# EAGLE design MC24LC512Shield (EAGLE 7.4.0)
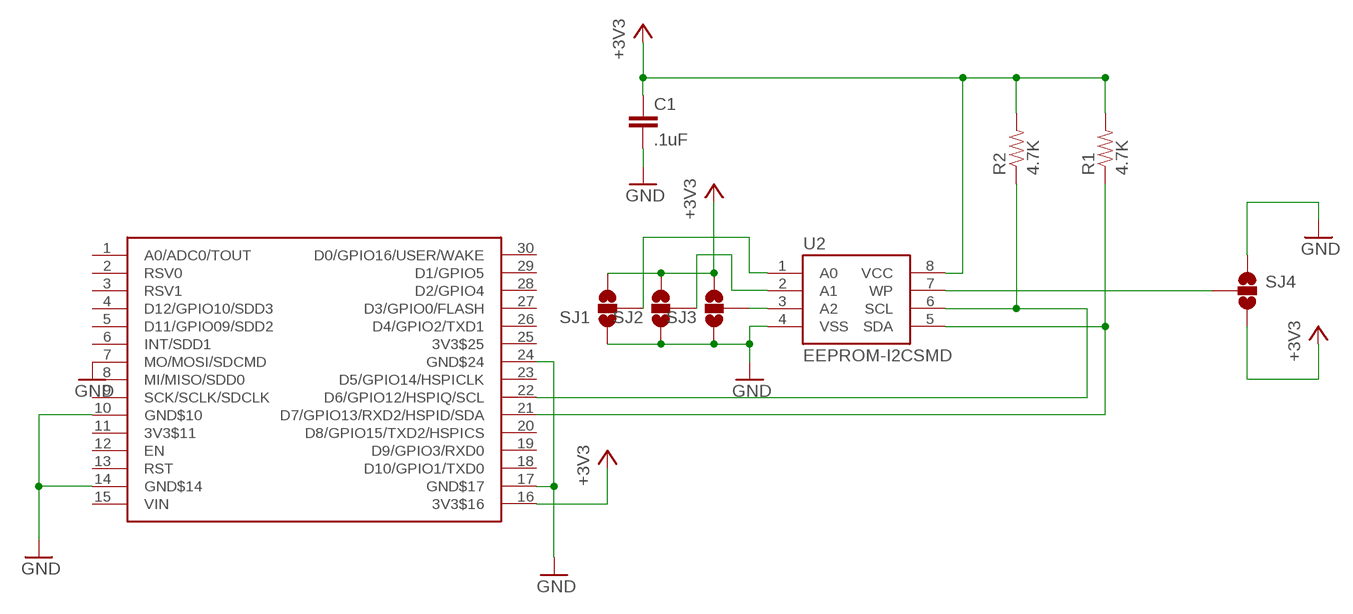
[diagram p0: schematic, sheet 1]

## Parts
C1  .1uF  CAP0603-CAP  [0603-CAP]
R1  4.7K  RESISTOR0603-RES  [0603-RES]
R2  4.7K  RESISTOR0603-RES  [0603-RES]
SJ1  SOLDERJUMPER_2WAYPASTE1&2  [SJ_3_PASTE1&2]
SJ2  SOLDERJUMPER_2WAYPASTE1&2  [SJ_3_PASTE1&2]
SJ3  SOLDERJUMPER_2WAYPASTE1&2  [SJ_3_PASTE1&2]
SJ4  SOLDERJUMPER_2WAYPASTE1&2  [SJ_3_PASTE1&2]
U2  EEPROM-I2CSMD  [SO08]
U$2  NERDSHIELD  [NERDUINO_STACK]

## Nets
+3V3: C1.1 R1.2 R2.2 SJ1.3 SJ2.3 SJ3.3 SJ4.3 U2.8(VCC) U$2.16(3V3$16)
GND: C1.2 SJ1.1 SJ2.1 SJ3.1 SJ4.1 U2.4(VSS) U$2.7(MO/MOSI/SDCMD) U$2.10(GND$10) U$2.14(GND$14) U$2.17(GND$17) U$2.24(GND$24)
N$2: R1.1 U2.5(SDA) U$2.21(D7/GPIO13/RXD2/HSPID/SDA)
N$4: SJ3.2 U2.3(A2)
N$5: R2.1 U2.6(SCL) U$2.22(D6/GPIO12/HSPIQ/SCL)
N$6: SJ2.2 U2.2(A1)
N$7: SJ1.2 U2.1(A0)
N$8: SJ4.2 U2.7(WP)
Unconnected: U$2.1(A0/ADC0/TOUT) U$2.2(RSV0) U$2.3(RSV1) U$2.4(D12/GPIO10/SDD3) U$2.5(D11/GPIO09/SDD2) U$2.6(INT/SDD1) U$2.8(MI/MISO/SDD0) U$2.9(SCK/SCLK/SDCLK) U$2.11(3V3$11) U$2.12(EN) U$2.13(RST) U$2.15(VIN) U$2.18(D10/GPIO1/TXD0) U$2.19(D9/GPIO3/RXD0) U$2.20(D8/GPIO15/TXD2/HSPICS) U$2.23(D5/GPIO14/HSPICLK) U$2.25(3V3$25) U$2.26(D4/GPIO2/TXD1) U$2.27(D3/GPIO0/FLASH) U$2.28(D2/GPIO4) U$2.29(D1/GPIO5) U$2.30(D0/GPIO16/USER/WAKE)

## Library data of the parts
C1 = SparkFun:CAP: Capacitor Standard 0603 ceramic capacitor, and 0.1" leaded capacitor.
R1 R2 = SparkFun:RESISTOR: Resistor Basic schematic elements and footprints for 0603, 1206, and PTH resistors.
SJ1-SJ4 = SparkFun:SOLDERJUMPER_2WAY: Solder Jumper 2 way solder jumper
U2 = SparkFun-DigitalIC:EEPROM-I2C: I2C EEPROM chips, 24LC256 (and others)
U$2 = NerduinoShieldLib:NERDSHIELD

## Board
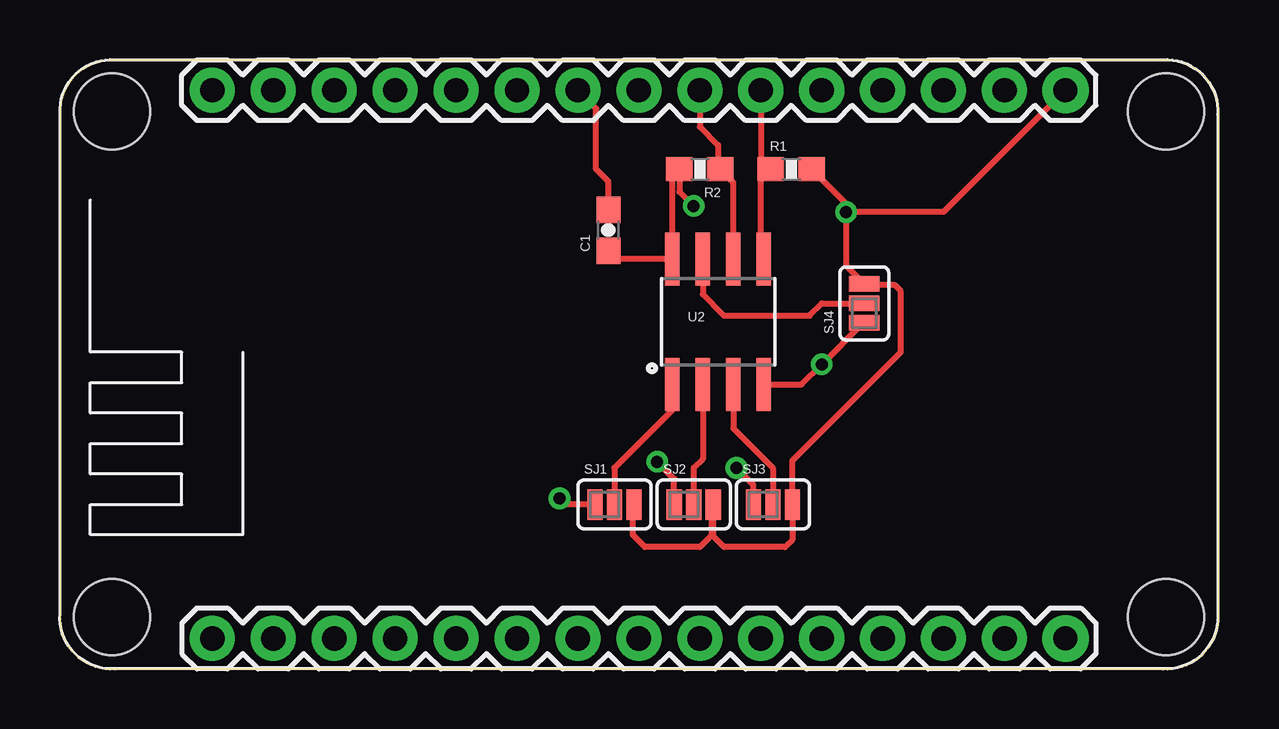
[diagram p1: board, top side]
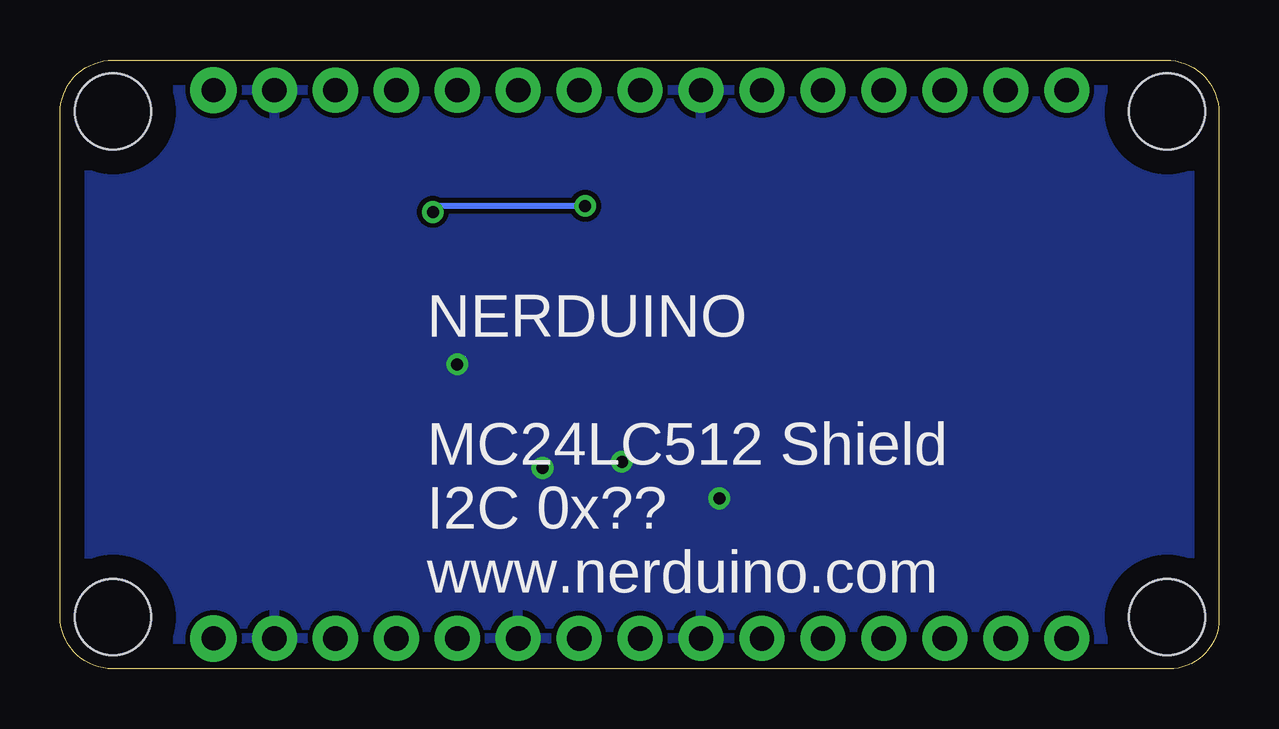
[diagram p2: board, bottom side, seen from below]

Size 48.31 x 25.39 mm. Coordinates in mm from the lower left corner, seen from the top.
Outline: 48.31,2.2 48.31,23.17 arc90 46.09,25.39 2.21,25.39 arc90 0,23.18 0,2.08 arc90 2.08,0 46.12,0 arc90 48.31,2.2
Copper layers (1*16): Top 0.035mm / dielectric 1.5mm / Bottom 0.035mm
Design rules "default": minimum track width 10mil, minimum drill 24mil, track to track 8mil, track to pad 8mil, pad to pad 8mil, via to via 8mil, smd to smd 8mil, copper to edge 40mil, drill to drill 8mil, minimum pad ring 10mil, minimum via ring 8mil, stop-mask expansion 4mil, vias tented up to drill 0mil, thermal gap 10mil

### Footprints (pad centres in the part's own frame; a part is rotated, then mirrored left to right if it is on the bottom)
0603-CAP = smd 1.1 x 1: 1 -0.85,0; 2 0.85,0
0603-RES = smd 1.1 x 1: 1 -0.85,0; 2 0.85,0
SJ_3_PASTE1&2 = smd 0.635 x 1.27: 1 -0.813,0; 2 0,0; 3 0.813,0
SO08 = smd 0.61 x 2.21: 1 -1.905,-2.616; 2 -0.635,-2.616; 3 0.635,-2.616; 4 1.905,-2.616; 5 1.905,2.616; 6 0.635,2.616; 7 -0.635,2.616; 8 -1.905,2.616
NERDUINO_STACK = drill 1.016 pad 1.88: 1 -17.78,-5.08; 2 -15.24,-5.08; 3 -12.7,-5.08; 4 -10.16,-5.08; 5 -7.62,-5.08; 6 -5.08,-5.08; 7 -2.54,-5.08; 8 0,-5.08; 9 2.54,-5.08; 10 5.08,-5.08; 11 7.62,-5.08; 12 10.16,-5.08; 13 12.7,-5.08; 14 15.24,-5.08; 17 15.24,17.78; 18 12.7,17.78; 19 10.16,17.78; 20 7.62,17.78; 21 5.08,17.78; 22 2.54,17.78; 23 0,17.78; 24 -2.54,17.78; 25 -5.08,17.78; 26 -7.62,17.78; 27 -10.16,17.78; 28 -12.7,17.78; 29 -15.24,17.78; 30 -17.78,17.78 | drill 1 pad 1.93: 15 17.78,-5.08; 16 17.78,17.78 | hole 3.175: -21.971,16.891; -21.971,-4.191; 21.971,-4.191; 21.971,16.891

### Placement (x,y rotation side)
C1  22.86,18.29 90 top
R1  30.48,20.83 0 top
R2  26.67,20.83 180 top
SJ1  23.11,6.86 0 top
SJ2  26.42,6.86 0 top
SJ3  29.72,6.86 0 top
SJ4  33.53,15.24 90 top
U2  27.43,14.48 0 top
U$2  24.13,6.35 0 top

### Tracks (layer width: path | path; a pad name or v marks a point on that pad's centre or on a via)
+3V3  (via drill 0.5)
  Top 0.254: SJ1.3 23.88,6.81 23.88,5.59 24.38,5.08 26.67,5.08 27.23,5.64 SJ2.3 27.18,6.81 27.18,5.59 27.69,5.08 30.23,5.08 30.53,5.38 SJ3.3 30.53,8.69 35.05,13.21 35.05,15.75 34.8,16 33.58,16 SJ4.3 32.77,16.81 v32.77,19.05 | C1.1 23.2,17.09 U2.8 25.53,20.54 R2.2 25.82,19.9 v26.42,19.3 | v32.77,19.05 32.77,19.39 R1.2 | U$2.16 36.83,19.05 v32.77,19.05
  Bottom 0.254: v26.42,19.3 32.51,19.3 v32.77,19.05
GND  (via drill 0.5)
  Top 0.254: SJ3.1 28.91,7.67 v28.19,8.38 | SJ2.1 25.6,7.93 v24.89,8.64 | SJ1.1 21.08,6.86 v20.83,7.11 | U2.4 30.91,11.86 v31.75,12.7 33.48,14.43 SJ4.1 | C1.2 22.86,20.32 22.35,20.83 22.35,23.37 U$2.24
  Bottom 0.254: v28.19,8.38 28.19,8.64 | v24.89,8.64 25.15,8.64 | v20.83,7.11 20.83,7.37 | v31.75,12.7 31.5,12.95
  pour Bottom: 0,25.4 48.26,25.27 48.51,0.13 0.25,0.25
N$2
  Top 0.254: U$2.21 29.21,21.25 R1.1 29.21,20.41 29.21,17.02 29.29,17.09 U2.5
N$4
  Top 0.254: U2.3 28.07,10.03 29.72,8.38 SJ3.2
N$5
  Top 0.254: U2.6 28.07,20.28 R2.1 27.43,20.92 27.43,21.84 26.67,22.61 U$2.22
N$6
  Top 0.254: U2.2 26.8,8.76 26.42,8.38 SJ2.2
N$7
  Top 0.254: U2.1 25.53,10.79 23.11,8.38 SJ1.2
N$8
  Top 0.254: U2.7 26.8,15.62 27.69,14.73 31.24,14.73 31.75,15.24 SJ4.2

### Text on the board
_bsilk: NERDUINO / / MC24LC512 Shield / I2C 0x?? / www.nerduino.com